# EAGLE schematic DRF1278F1 (EAGLE 6.5.0)
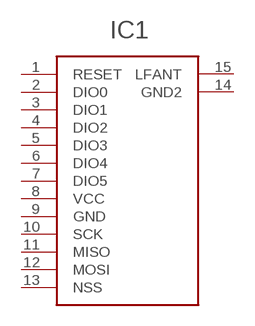
[diagram p0: schematic, sheet 1]

## Parts
IC1  DRF1278F  DRF1278F_2  [DRF1278F_2]
Unconnected: IC1.1(RESET) IC1.2(DIO0) IC1.3(DIO1) IC1.4(DIO2) IC1.5(DIO3) IC1.6(DIO4) IC1.7(DIO5) IC1.8(VCC) IC1.9(GND) IC1.10(SCK) IC1.11(MISO) IC1.12(MOSI) IC1.13(NSS) IC1.14(GND2) IC1.15(LFANT)

## Library data of the parts
IC1 = LMA2:DRF1278F_2

## Net classes
0 default: width 0.152 mm
1 POWER: width 0.635 mm
2 VDD: width 0.635 mm
3 gpspower: width 0.635 mm